# Altium schematic sheet Temp_Sense.SchDoc
size A4; SheetNumber: 2; SheetTotal: 6
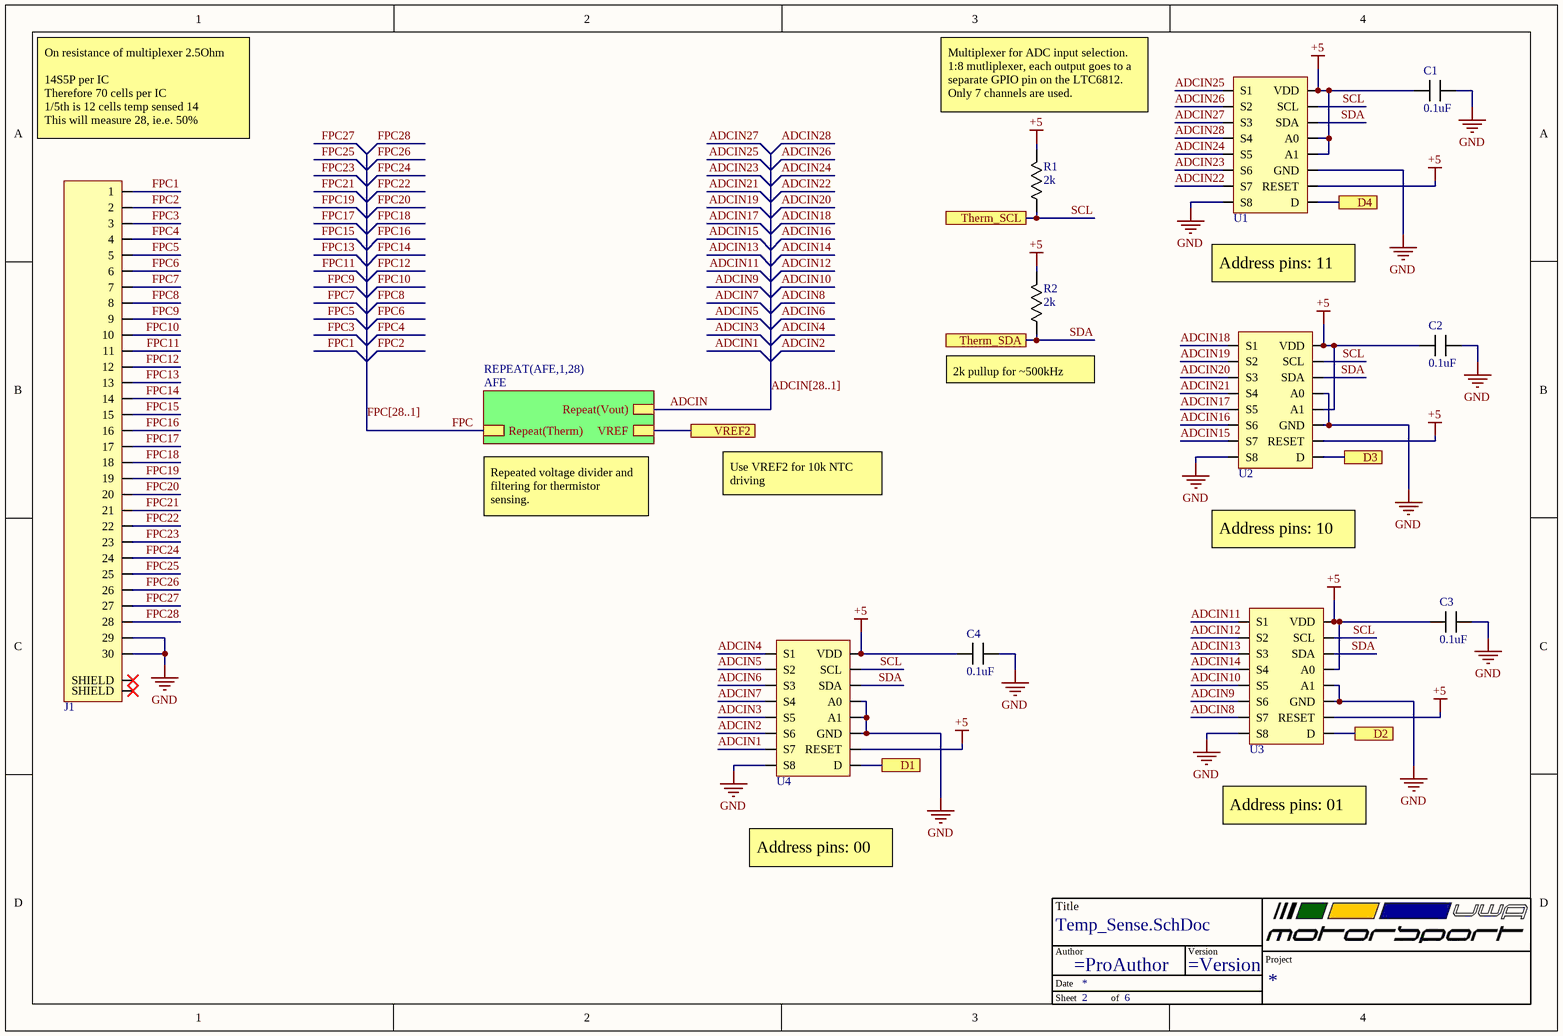
[diagram p0: Temp_Sense.SchDoc]

## Parts
*  TitleBlock  (value not drawn)  (graphical)
C1  value 0.1uF  [C_0603]  (hidden comment: C)
C2  value 0.1uF  [C_0603]  (hidden comment: C)
C3  value 0.1uF  [C_0603]  (hidden comment: C)
C4  value 0.1uF  [C_0603]  (hidden comment: C)
J1  3-84953-0  [3-84953-0]  (value not drawn)
R1  value 2k  [R-0603]  (hidden comment: Resistor)
R2  value 2k  [R-0603]  (hidden comment: Resistor)
U1  ADG728  [ADG728]  (value not drawn)
U2  ADG728  [ADG728]  (value not drawn)
U3  ADG728  [ADG728]  (value not drawn)
U4  ADG728  [ADG728]  (value not drawn)

## Sub-sheets
REPEAT(AFE,1,28) = AFE: Repeat(Vout), Repeat(Therm), VREF

## Ports
D1, D2, D3, D4, Therm_SCL, Therm_SDA, VREF2

## Nets
+5: C1.2 C2.2 C3.2 C4.2 R1.2 R2.2 U1.2(RESET) U1.13(VDD) U1.15(A1) U1.16(A0) U2.2(RESET) U2.13(VDD) U2.15(A1) U3.2(RESET) U3.13(VDD) U3.16(A0) U4.2(RESET) U4.13(VDD)
GND: C1.1 C2.1 C3.1 C4.1 J1.29 J1.30 U1.9(S8) U1.14(GND) U2.9(S8) U2.14(GND) U2.16(A0) U3.9(S8) U3.14(GND) U3.15(A1) U4.9(S8) U4.14(GND) U4.15(A1) U4.16(A0)
ADCIN: sheet REPEAT(AFE,1,28)/Repeat(Vout)
ADCIN1: U4.10(S7)
ADCIN2: U4.11(S6)
ADCIN3: U4.12(S5)
ADCIN4: U4.4(S1)
ADCIN5: U4.5(S2)
ADCIN6: U4.6(S3)
ADCIN7: U4.7(S4)
ADCIN8: U3.10(S7)
ADCIN9: U3.11(S6)
ADCIN10: U3.12(S5)
ADCIN11: U3.4(S1)
ADCIN12: U3.5(S2)
ADCIN13: U3.6(S3)
ADCIN14: U3.7(S4)
ADCIN15: U2.10(S7)
ADCIN16: U2.11(S6)
ADCIN17: U2.12(S5)
ADCIN18: U2.4(S1)
ADCIN19: U2.5(S2)
ADCIN20: U2.6(S3)
ADCIN21: U2.7(S4)
ADCIN22: U1.10(S7)
ADCIN23: U1.11(S6)
ADCIN24: U1.12(S5)
ADCIN25: U1.4(S1)
ADCIN26: U1.5(S2)
ADCIN27: U1.6(S3)
ADCIN28: U1.7(S4)
D1: U4.8(D) ; port D1
D2: U3.8(D) ; port D2
D3: U2.8(D) ; port D3
D4: U1.8(D) ; port D4
FPC: sheet REPEAT(AFE,1,28)/Repeat(Therm)
FPC1: J1.1
FPC2: J1.2
FPC3: J1.3
FPC4: J1.4
FPC5: J1.5
FPC6: J1.6
FPC7: J1.7
FPC8: J1.8
FPC9: J1.9
FPC10: J1.10
FPC11: J1.11
FPC12: J1.12
FPC13: J1.13
FPC14: J1.14
FPC15: J1.15
FPC16: J1.16
FPC17: J1.17
FPC18: J1.18
FPC19: J1.19
FPC20: J1.20
FPC21: J1.21
FPC22: J1.22
FPC23: J1.23
FPC24: J1.24
FPC25: J1.25
FPC26: J1.26
FPC27: J1.27
FPC28: J1.28
SCL: R1.1 U1.1(SCL) U2.1(SCL) U3.1(SCL) U4.1(SCL) ; port Therm_SCL
SDA: R2.1 U1.3(SDA) U2.3(SDA) U3.3(SDA) U4.3(SDA) ; port Therm_SDA
VREF2: port VREF2, sheet REPEAT(AFE,1,28)/VREF

Not connected (* = marked no-connect by the designer): J1 S1(SHIELD)* S2(SHIELD)*

## Buses and harness runs
bus ADCIN[28..1]
bus FPC[28..1]

## Notes on the sheet
- (near R1) Multiplexer for ADC input selection. 1:8 mutliplexer, each output goes to a separate GPIO pin on the LTC6812. Only 7 channels are used.
- (near J1) On resistance of multiplexer 2.5Ohm
  14S5P per IC
  Therefore 70 cells per IC
  1/5th is 12 cells temp sensed 14
  This will measure 28, ie.e. 50%
- Address pins: 11
- (near R2) 2k pullup for ~500kHz
- Repeated voltage divider and filtering for thermistor sensing.
- Use VREF2 for 10k NTC driving
- Address pins: 10
- (near U3) Address pins: 01
- Address pins: 00
- (in symbol TitleBlock) Title; Author; Version; Project; Date; Sheet; of

## Library data of the parts
C1-C4 = Capacitor: ComponentLink1Description: New link; ComponentLink1URL: *
J1 = 3-84953-0: CONN FPC TOP 30POS 1.00MM R/A; Manufacturer: TE Connectivity; Body Plating: Tin; Actuator Material: Nylon,Glass,Polyamide; Actuator Color: Black; Number of Contacts: 30; Current Rating: 1A; Voltage Rating: 200V; Contact Resistance: 10mR; Gender: Female; Shielding: Unshielded; Connector Type: Receptacle,Connector,Socket; Wire/Cable Type: Flat Flex; Connector System: Flex-to-Board; Mating Alignment: Yes (With); PCB Mount Alignment: No (Without); PCB Mount Retention: With; PCB Mounting Orientation: Right Angle; Insulation: Non-Insulated; Pitch: 0.039inch; Plating Thickness: 2um; Pin Diameter: 0.2mm; Supplier 1: Mouser; Manufacturer Part Number: 3-84953-0; RoHS: Yes; Category: FFC / FPC; Stock 1: 14380; Pricing 1: 1=1.65000, 10=1.41000, 50=1.41000, 100=1.22000, 500=1.07000, 1000=1.07000, 1200=0.91500, 2400=0.87100, 10000=0.87100 (USD); Mount: Surface Mount,Through Hole; Contact Plating: Tin,Bright; Contact Material: Bronze; Color: Natural; Material: Thermoplastic; Housing Color: Natural; Housing Material: Polymer; Min Operating Temperature: -40°C; Max Operating Temperature: 85°C; Number of Rows: 1; Termination: SMD/SMT; Orientation: Right Angle; Package Quantity: 1200; Packaging: Tape and Reel; Max Voltage Rating (AC): 200V; Number of Positions: 30; Contact Location: Top; Sealable: No (Without); Shrouded: Yes (With); Contact Current Rating: 1A; Series: -; Length: 37.92mm; Width: 0.2575inch; Height: 2.56mm; Lead Pitch: 1mm; Depth: 7.3mm; Radiation Hardening: No; REACH SVHC: No SVHC; ELV: Compliant; Flammability Rating: UL94 V-0; ComponentLink1URL: https://datasheet.ciiva.com/11745/0900766b806d28d6-11745122.pdf?src-supplier=RSComponents; ComponentLink1Description: https://datasheet.ciiva.com/11745/0900766b806d28d6-11745122.pdf?src-supplier=RSComponents; ComponentLink2URL: https://datasheet.ciiva.com/1437/eng-cd-84953-a3-1437863.pdf?src-supplier=Element14; ComponentLink2Description: https://datasheet.ciiva.com/1437/eng-cd-84953-a3-1437863.pdf?src-supplier=Element14; ComponentLink3URL: https://datasheet.ciiva.com/1437/eng-cd-84953-a3-1437862.pdf?src-supplier=Element14; ComponentLink3Description: https://datasheet.ciiva.com/1437/eng-cd-84953-a3-1437862.pdf?src-supplier=Element14; ComponentLink4URL: https://datasheet.ciiva.com/5750/586796-5750949.pdf?src-supplier=Farnell; ComponentLink4Description: https://datasheet.ciiva.com/5750/586796-5750949.pdf?src-supplier=Farnell; ComponentLink5URL: https://datasheet.ciiva.com/10034/eng-ds-1-1773440-6-0506-10034394.pdf?src-supplier=Avnet; ComponentLink5Description: https://datasheet.ciiva.com/10034/eng-ds-1-1773440-6-0506-10034394.pdf?src-supplier=Avnet; ComponentLink6URL: https://datasheet.ciiva.com/30052/eng-ds-1-1773440-6-0506-30052600.pdf?src-supplier=Onlinecomponents.com; ComponentLink6Description: https://datasheet.ciiva.com/30052/eng-ds-1-1773440-6-0506-30052600.pdf?src-supplier=Onlinecomponents.com; ComponentLink7URL: https://datasheet.ciiva.com/669/eng-cd-84953-a3-669167.pdf?src-supplier=Digi-Key; ComponentLink7Description: https://datasheet.ciiva.com/669/eng-cd-84953-a3-669167.pdf?src-supplier=Digi-Key; ComponentLink8URL: https://datasheet.ciiva.com/669/eng-cd-84953-a3-669168.pdf?src-supplier=Digi-Key; ComponentLink8Description: https://datasheet.ciiva.com/669/eng-cd-84953-a3-669168.pdf?src-supplier=Digi-Key; ComponentLink9URL: https://datasheet.ciiva.com/669/eng-cd-84953-a3-669166.pdf?src-supplier=Digi-Key; ComponentLink9Description: https://datasheet.ciiva.com/669/eng-cd-84953-a3-669166.pdf?src-supplier=Digi-Key; Supplier Part Number 1: 571-3-84953-0
U1-U4 = ADG728: Analog Multiplexer Single 8:1 16-Pin TSSOP Tube; Manufacturer: Analog Devices; Manufacturer Part Number: ADG728BRUZ; Min Supply Voltage: 2.7V; Max Supply Voltage: 5.5V; On-State Resistance: 4.5R; Throw Configuration: DPST; Number of Circuits: 1; -3db Bandwidth: 65MHz; Max Power Dissipation: 100uW; Number of Inputs: 8; Max Supply Current: 20uA; Interface: Serial,2-Wire; Operating Supply Current: 10uA; Turn-Off Delay Time: 85ns; Turn-On Delay Time: 95ns; High Level Output Current: 120mA; Drain to Source Resistance: 2.5R; Supplier 1: Mouser; RoHS: Yes; Category: Decoders and Multiplexers; Stock 1: 392; Pricing 1: 1=6.74000, 10=6.06000, 50=5.73000, 100=4.96000, 1000=3.59000, 10000=3.59000 (USD); Case/Package: TSSOP; Number of Pins: 16; Contact Plating: Tin,Matte; Min Operating Temperature: -40°C; Max Operating Temperature: 85°C; Packaging: Rail/Tube; Package Quantity: 96; Series: -; Number of Channels: 1; Number of Outputs: 1; Bandwidth: 65MHz; Number of Bits: 8; Nominal Supply Current: 20uA; Supply Current: 20uA; Length: 5mm; Width: 4.4mm; Height: 1.05mm; Radiation Hardening: No; Lead Free: Contains Lead; RoHS Compliant: Yes; REACH SVHC: No SVHC; ComponentLink1URL: https://datasheet.ciiva.com/1171/1610644-1171108.pdf?src-supplier=Element14; ComponentLink1Description: https://datasheet.ciiva.com/1171/1610644-1171108.pdf?src-supplier=Element14; ComponentLink2URL: https://datasheet.ciiva.com/5797/adg728-729-5797207.pdf?src-supplier=Farnell; ComponentLink2Description: https://datasheet.ciiva.com/5797/adg728-729-5797207.pdf?src-supplier=Farnell; ComponentLink3URL: https://datasheet.ciiva.com/1668/adg728-729-1668904.pdf?src-supplier=Digi-Key; ComponentLink3Description: https://datasheet.ciiva.com/1668/adg728-729-1668904.pdf?src-supplier=Digi-Key; ComponentLink4URL: https://datasheet.ciiva.com/2978/adg728-729-2978667.pdf?src-supplier=Avnet; ComponentLink4Description: https://datasheet.ciiva.com/2978/adg728-729-2978667.pdf?src-supplier=Avnet; ComponentLink5URL: https://datasheet.ciiva.com/7986/adg728-729-7986413.pdf?src-supplier=Element14; ComponentLink5Description: https://datasheet.ciiva.com/7986/adg728-729-7986413.pdf?src-supplier=Element14; ComponentLink6URL: https://datasheet.ciiva.com/48708/001248036-da-01-en-ic-mux-demux-8x1-adg728bruz-tssop-16-adi-48708636.pdf?src-supplier=Conrad; ComponentLink6Description: https://datasheet.ciiva.com/48708/001248036-da-01-en-ic-mux-demux-8x1-adg728bruz-tssop-16-adi-48708636.pdf?src-supplier=Conrad; Supplier Part Number 1: 584-ADG728BRUZ